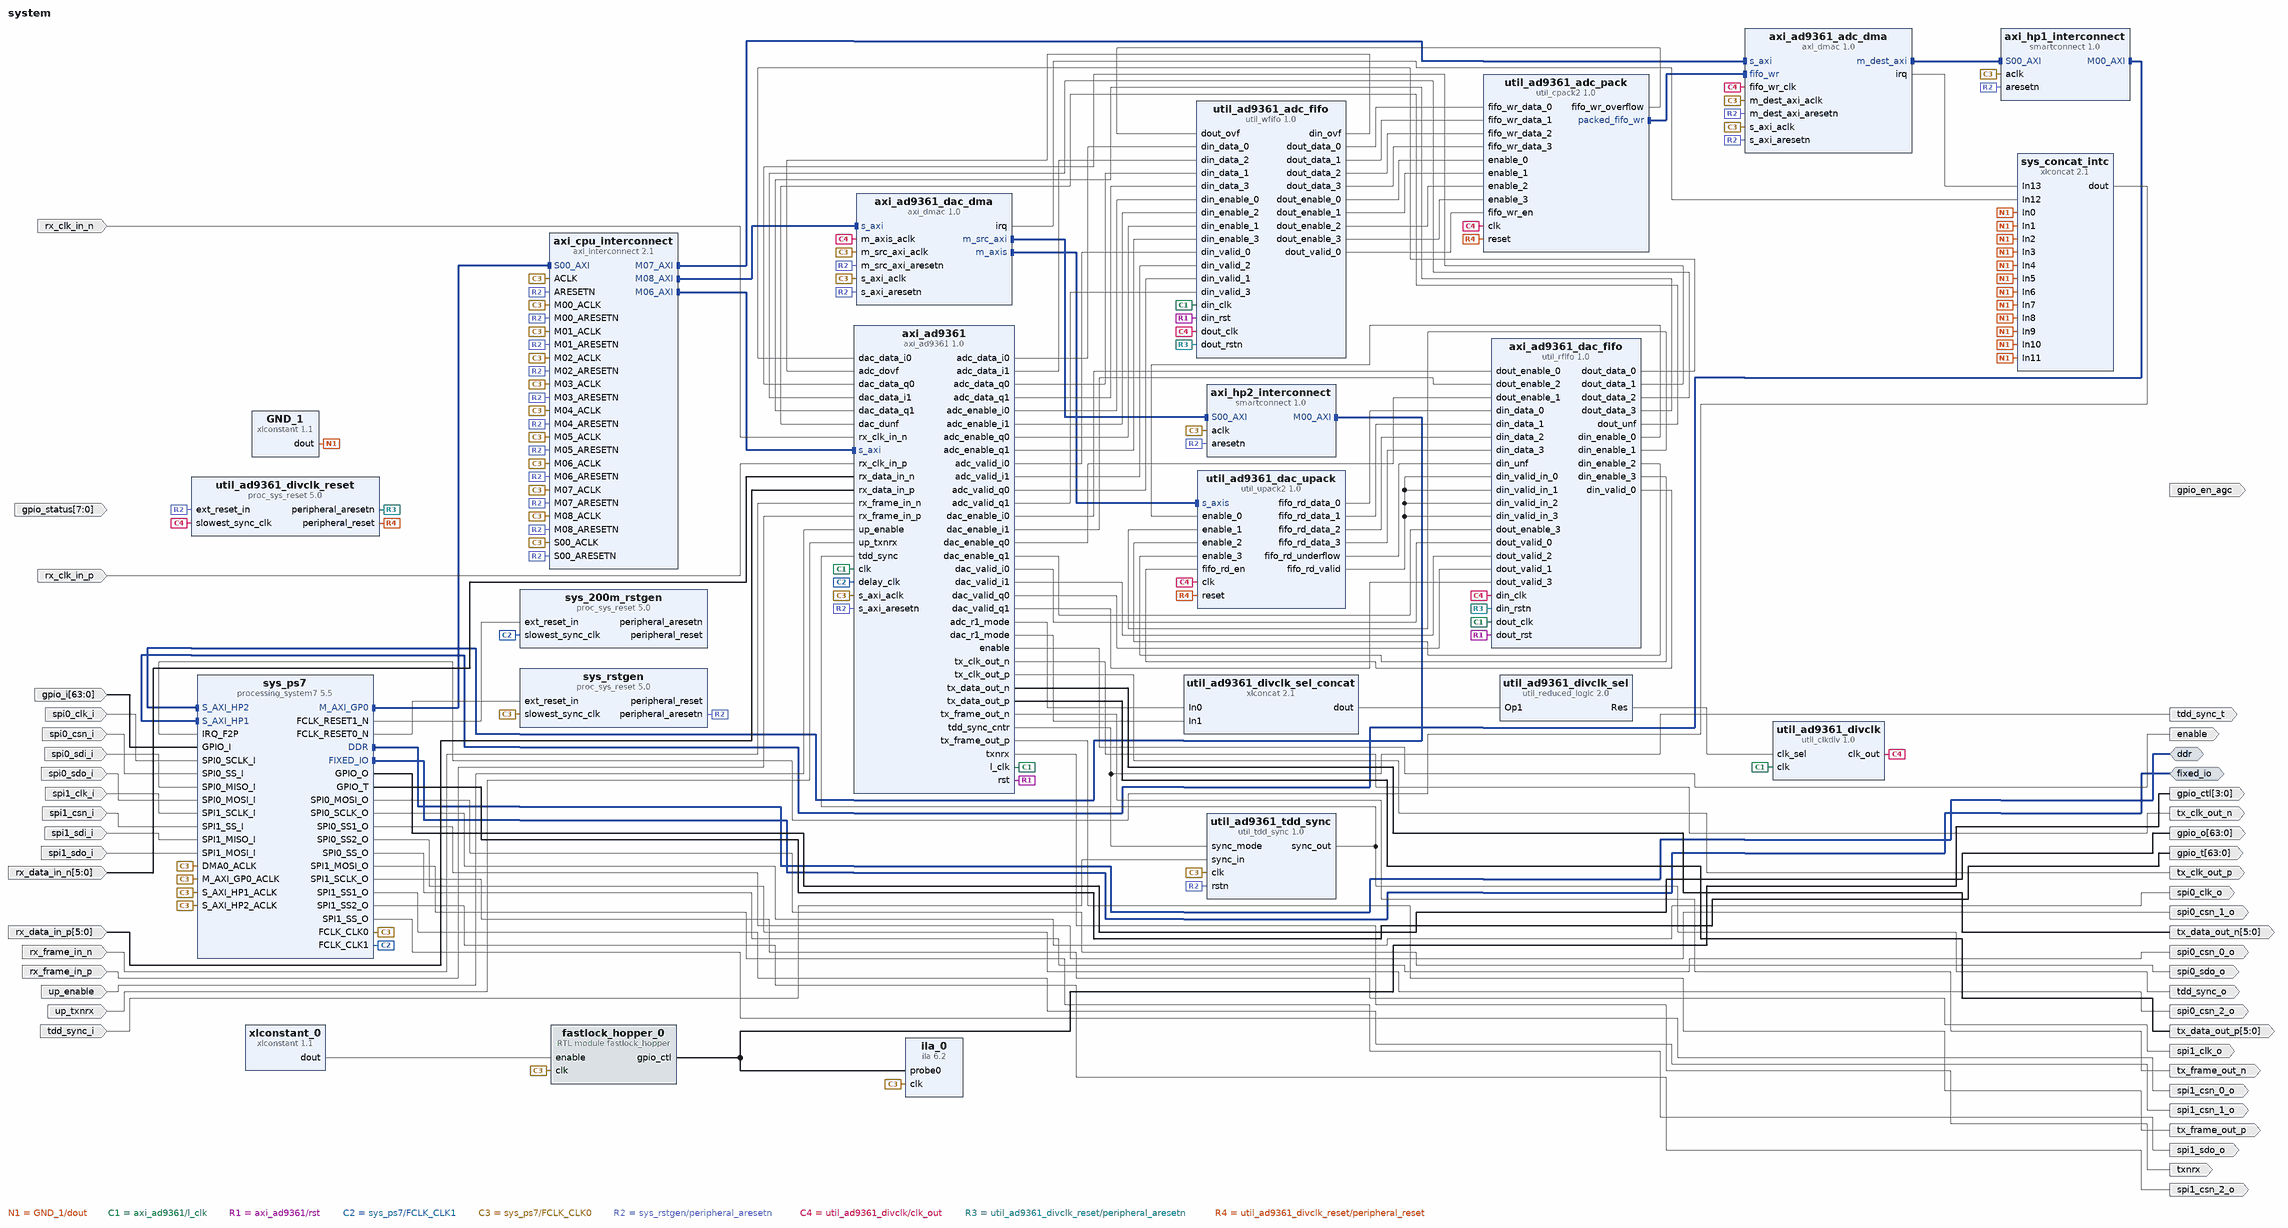
[diagram p0: block diagram of the top level]
# Vivado block design system, xc7z020clg400-2, Vivado 2021.1
create_bd_design system

create_bd_intf_port -mode Master -vlnv xilinx.com:interface:ddrx_rtl:1.0 ddr
create_bd_intf_port -mode Master -vlnv xilinx.com:display_processing_system7:fixedio_rtl:1.0 fixed_io
create_bd_port -dir O spi0_csn_2_o
create_bd_port -dir O spi0_csn_1_o
create_bd_port -dir O spi0_csn_0_o
create_bd_port -dir I spi0_csn_i
create_bd_port -dir I spi0_clk_i
create_bd_port -dir O spi0_clk_o
create_bd_port -dir I spi0_sdo_i
create_bd_port -dir O spi0_sdo_o
create_bd_port -dir I spi0_sdi_i
create_bd_port -dir O spi1_csn_2_o
create_bd_port -dir O spi1_csn_1_o
create_bd_port -dir O spi1_csn_0_o
create_bd_port -dir I spi1_csn_i
create_bd_port -dir I spi1_clk_i
create_bd_port -dir O spi1_clk_o
create_bd_port -dir I spi1_sdo_i
create_bd_port -dir O spi1_sdo_o
create_bd_port -dir I spi1_sdi_i
create_bd_port -dir I -from 63 -to 0 gpio_i
create_bd_port -dir O -from 63 -to 0 gpio_o
create_bd_port -dir O -from 63 -to 0 gpio_t
create_bd_port -dir I rx_clk_in_p
create_bd_port -dir I rx_clk_in_n
create_bd_port -dir I rx_frame_in_p
create_bd_port -dir I rx_frame_in_n
create_bd_port -dir I -from 5 -to 0 rx_data_in_p
create_bd_port -dir I -from 5 -to 0 rx_data_in_n
create_bd_port -dir O tx_clk_out_p
create_bd_port -dir O tx_clk_out_n
create_bd_port -dir O tx_frame_out_p
create_bd_port -dir O tx_frame_out_n
create_bd_port -dir O -from 5 -to 0 tx_data_out_p
create_bd_port -dir O -from 5 -to 0 tx_data_out_n
create_bd_port -dir O enable
create_bd_port -dir O txnrx
create_bd_port -dir I up_enable
create_bd_port -dir I up_txnrx
create_bd_port -dir O tdd_sync_o
create_bd_port -dir I tdd_sync_i
create_bd_port -dir O tdd_sync_t
create_bd_port -dir O -from 3 -to 0 -type data gpio_ctl
create_bd_port -dir I -from 7 -to 0 -type data gpio_status
create_bd_port -dir O gpio_en_agc

create_bd_cell -type ip -vlnv xilinx.com:ip:xlconstant:1.1 GND_1
set_property -dict {CONFIG.CONST_VAL 0 CONFIG.CONST_WIDTH 1} [get_bd_cells GND_1]
create_bd_cell -type ip -vlnv analog.com:user:axi_ad9361:1.0 axi_ad9361
set_property -dict [list \
  CONFIG.ADC_INIT_DELAY 23 \
  CONFIG.DAC_DDS_CORDIC_DW 14 \
  CONFIG.DAC_DDS_TYPE 1 \
  CONFIG.ID 0 \
] [get_bd_cells axi_ad9361]
create_bd_cell -type ip -vlnv analog.com:user:axi_dmac:1.0 axi_ad9361_adc_dma
set_property -dict [list \
  CONFIG.ALLOW_ASYM_MEM 1 \
  CONFIG.AXI_SLICE_DEST false \
  CONFIG.AXI_SLICE_SRC false \
  CONFIG.CYCLIC false \
  CONFIG.DMA_2D_TRANSFER false \
  CONFIG.DMA_AXI_PROTOCOL_DEST 1 \
  CONFIG.DMA_DATA_WIDTH_SRC 64 \
  CONFIG.DMA_TYPE_DEST 0 \
  CONFIG.DMA_TYPE_SRC 2 \
  CONFIG.SYNC_TRANSFER_START true \
] [get_bd_cells axi_ad9361_adc_dma]
create_bd_cell -type ip -vlnv analog.com:user:axi_dmac:1.0 axi_ad9361_dac_dma
set_property -dict [list \
  CONFIG.ALLOW_ASYM_MEM 1 \
  CONFIG.AXI_SLICE_DEST false \
  CONFIG.AXI_SLICE_SRC false \
  CONFIG.CYCLIC true \
  CONFIG.DMA_2D_TRANSFER false \
  CONFIG.DMA_AXI_PROTOCOL_SRC 1 \
  CONFIG.DMA_DATA_WIDTH_DEST 64 \
  CONFIG.DMA_TYPE_DEST 1 \
  CONFIG.DMA_TYPE_SRC 0 \
] [get_bd_cells axi_ad9361_dac_dma]
create_bd_cell -type ip -vlnv analog.com:user:util_rfifo:1.0 axi_ad9361_dac_fifo
set_property -dict [list \
  CONFIG.DIN_ADDRESS_WIDTH 4 \
  CONFIG.DIN_DATA_WIDTH 16 \
  CONFIG.DOUT_DATA_WIDTH 16 \
] [get_bd_cells axi_ad9361_dac_fifo]
create_bd_cell -type ip -vlnv xilinx.com:ip:axi_interconnect:2.1 axi_cpu_interconnect
set_property -dict {CONFIG.NUM_MI 9} [get_bd_cells axi_cpu_interconnect]
create_bd_cell -type ip -vlnv xilinx.com:ip:smartconnect:1.0 axi_hp1_interconnect
set_property -dict {CONFIG.NUM_MI 1 CONFIG.NUM_SI 1} [get_bd_cells axi_hp1_interconnect]
create_bd_cell -type ip -vlnv xilinx.com:ip:smartconnect:1.0 axi_hp2_interconnect
set_property -dict {CONFIG.NUM_MI 1 CONFIG.NUM_SI 1} [get_bd_cells axi_hp2_interconnect]
create_bd_cell -type ip -vlnv xilinx.com:ip:proc_sys_reset:5.0 sys_200m_rstgen
set_property -dict {CONFIG.C_EXT_RST_WIDTH 1} [get_bd_cells sys_200m_rstgen]
create_bd_cell -type ip -vlnv xilinx.com:ip:xlconcat:2.1 sys_concat_intc
set_property -dict {CONFIG.NUM_PORTS 16} [get_bd_cells sys_concat_intc]
create_bd_cell -type ip -vlnv xilinx.com:ip:processing_system7:5.5 sys_ps7
set_property -dict [list \
  CONFIG.PCW_APU_PERIPHERAL_FREQMHZ 666.666666 \
  CONFIG.PCW_CPU_CPU_6X4X_MAX_RANGE 767 \
  CONFIG.PCW_ENET0_ENET0_IO {MIO 16 .. 27} \
  CONFIG.PCW_ENET0_GRP_MDIO_ENABLE 1 \
  CONFIG.PCW_ENET0_GRP_MDIO_IO {MIO 52 .. 53} \
  CONFIG.PCW_ENET0_PERIPHERAL_ENABLE 1 \
  CONFIG.PCW_ENET_RESET_ENABLE 0 \
  CONFIG.PCW_EN_CLK1_PORT 1 \
  CONFIG.PCW_EN_RST1_PORT 1 \
  CONFIG.PCW_FCLK_CLK1_BUF TRUE \
  CONFIG.PCW_FPGA0_PERIPHERAL_FREQMHZ 100.0 \
  CONFIG.PCW_FPGA1_PERIPHERAL_FREQMHZ 200.0 \
  CONFIG.PCW_FPGA_FCLK1_ENABLE 1 \
  CONFIG.PCW_GPIO_EMIO_GPIO_ENABLE 1 \
  CONFIG.PCW_GPIO_EMIO_GPIO_IO 64 \
  CONFIG.PCW_GPIO_MIO_GPIO_ENABLE 1 \
  CONFIG.PCW_GPIO_MIO_GPIO_IO MIO \
  CONFIG.PCW_I2C_RESET_ENABLE 0 \
  CONFIG.PCW_IMPORT_BOARD_PRESET ZC702 \
  CONFIG.PCW_IRQ_F2P_INTR 1 \
  CONFIG.PCW_PERIPHERAL_BOARD_PRESET part0 \
  CONFIG.PCW_PRESET_BANK1_VOLTAGE {LVCMOS 1.8V} \
  CONFIG.PCW_QSPI_GRP_SINGLE_SS_ENABLE 1 \
  CONFIG.PCW_QSPI_GRP_SINGLE_SS_IO {MIO 1 .. 6} \
  CONFIG.PCW_QSPI_PERIPHERAL_ENABLE 1 \
  CONFIG.PCW_QSPI_PERIPHERAL_FREQMHZ 120 \
  CONFIG.PCW_QSPI_QSPI_IO {MIO 1 .. 6} \
  CONFIG.PCW_SD0_GRP_CD_ENABLE 0 \
  CONFIG.PCW_SD0_GRP_WP_ENABLE 0 \
  CONFIG.PCW_SD0_PERIPHERAL_ENABLE 1 \
  CONFIG.PCW_SD0_SD0_IO {MIO 40 .. 45} \
  CONFIG.PCW_SDIO_PERIPHERAL_FREQMHZ 50 \
  CONFIG.PCW_SINGLE_QSPI_DATA_MODE x4 \
  CONFIG.PCW_SPI0_PERIPHERAL_ENABLE 1 \
  CONFIG.PCW_SPI0_SPI0_IO EMIO \
  CONFIG.PCW_SPI1_PERIPHERAL_ENABLE 1 \
  CONFIG.PCW_SPI1_SPI1_IO EMIO \
  CONFIG.PCW_UART1_PERIPHERAL_ENABLE 1 \
  CONFIG.PCW_UART1_UART1_IO {MIO 8 .. 9} \
  CONFIG.PCW_UART_PERIPHERAL_FREQMHZ 50 \
  CONFIG.PCW_UIPARAM_DDR_FREQ_MHZ 533.333 \
  CONFIG.PCW_UIPARAM_DDR_MEMORY_TYPE {DDR 3 (Low Voltage)} \
  CONFIG.PCW_UIPARAM_DDR_PARTNO {MT41K256M16 RE-125} \
  CONFIG.PCW_USB0_PERIPHERAL_ENABLE 1 \
  CONFIG.PCW_USB0_RESET_ENABLE 1 \
  CONFIG.PCW_USB0_RESET_IO {MIO 46} \
  CONFIG.PCW_USB0_USB0_IO {MIO 28 .. 39} \
  CONFIG.PCW_USB_RESET_ENABLE 1 \
  CONFIG.PCW_USB_RESET_SELECT {Share reset pin} \
  CONFIG.PCW_USE_DMA0 1 \
  CONFIG.PCW_USE_FABRIC_INTERRUPT 1 \
  CONFIG.PCW_USE_S_AXI_HP1 1 \
  CONFIG.PCW_USE_S_AXI_HP2 1 \
] [get_bd_cells sys_ps7]
# 519 more settings of sys_ps7 are not shown: defaults, MIO pin electricals, DDR timing, and values the tool derives
create_bd_cell -type ip -vlnv xilinx.com:ip:proc_sys_reset:5.0 sys_rstgen
set_property -dict {CONFIG.C_EXT_RST_WIDTH 1} [get_bd_cells sys_rstgen]
create_bd_cell -type ip -vlnv analog.com:user:util_wfifo:1.0 util_ad9361_adc_fifo
set_property -dict [list \
  CONFIG.DIN_ADDRESS_WIDTH 4 \
  CONFIG.DIN_DATA_WIDTH 16 \
  CONFIG.DOUT_DATA_WIDTH 16 \
  CONFIG.NUM_OF_CHANNELS 4 \
] [get_bd_cells util_ad9361_adc_fifo]
create_bd_cell -type ip -vlnv analog.com:user:util_cpack2:1.0 util_ad9361_adc_pack
set_property -dict {CONFIG.NUM_OF_CHANNELS 4 CONFIG.SAMPLE_DATA_WIDTH 16} [get_bd_cells util_ad9361_adc_pack]
create_bd_cell -type ip -vlnv analog.com:user:util_upack2:1.0 util_ad9361_dac_upack
set_property -dict {CONFIG.NUM_OF_CHANNELS 4 CONFIG.SAMPLE_DATA_WIDTH 16} [get_bd_cells util_ad9361_dac_upack]
create_bd_cell -type ip -vlnv analog.com:user:util_clkdiv:1.0 util_ad9361_divclk
create_bd_cell -type ip -vlnv xilinx.com:ip:proc_sys_reset:5.0 util_ad9361_divclk_reset
create_bd_cell -type ip -vlnv xilinx.com:ip:util_reduced_logic:2.0 util_ad9361_divclk_sel
set_property -dict {CONFIG.C_SIZE 2} [get_bd_cells util_ad9361_divclk_sel]
create_bd_cell -type ip -vlnv xilinx.com:ip:xlconcat:2.1 util_ad9361_divclk_sel_concat
set_property -dict {CONFIG.NUM_PORTS 2} [get_bd_cells util_ad9361_divclk_sel_concat]
create_bd_cell -type ip -vlnv analog.com:user:util_tdd_sync:1.0 util_ad9361_tdd_sync
set_property -dict {CONFIG.TDD_SYNC_PERIOD 10000000} [get_bd_cells util_ad9361_tdd_sync]
create_bd_cell -type ip -vlnv xilinx.com:ip:ila:6.2 ila_0
set_property -dict [list \
  CONFIG.ALL_PROBE_SAME_MU true \
  CONFIG.C_MONITOR_TYPE Native \
  CONFIG.C_NUM_OF_PROBES 1 \
  CONFIG.C_PROBE0_WIDTH 4 \
  CONFIG.C_TRIGIN_EN false \
] [get_bd_cells ila_0]
create_bd_cell -type ip -vlnv xilinx.com:ip:xlconstant:1.1 xlconstant_0
create_bd_cell -type module -reference fastlock_hopper fastlock_hopper_0

# ---- connections ----

connect_bd_intf_net [get_bd_intf_pins axi_cpu_interconnect/S00_AXI] [get_bd_intf_pins sys_ps7/M_AXI_GP0]
connect_bd_intf_net [get_bd_intf_pins axi_hp1_interconnect/S00_AXI] [get_bd_intf_pins axi_ad9361_adc_dma/m_dest_axi]
connect_bd_intf_net [get_bd_intf_pins axi_ad9361_dac_dma/m_axis] [get_bd_intf_pins util_ad9361_dac_upack/s_axis]
connect_bd_intf_net [get_bd_intf_pins axi_hp2_interconnect/S00_AXI] [get_bd_intf_pins axi_ad9361_dac_dma/m_src_axi]
connect_bd_intf_net [get_bd_intf_pins axi_cpu_interconnect/M06_AXI] [get_bd_intf_pins axi_ad9361/s_axi]
connect_bd_intf_net [get_bd_intf_pins axi_cpu_interconnect/M07_AXI] [get_bd_intf_pins axi_ad9361_adc_dma/s_axi]
connect_bd_intf_net [get_bd_intf_pins axi_cpu_interconnect/M08_AXI] [get_bd_intf_pins axi_ad9361_dac_dma/s_axi]
connect_bd_intf_net [get_bd_intf_pins axi_hp1_interconnect/M00_AXI] [get_bd_intf_pins sys_ps7/S_AXI_HP1]
connect_bd_intf_net [get_bd_intf_pins axi_hp2_interconnect/M00_AXI] [get_bd_intf_pins sys_ps7/S_AXI_HP2]
connect_bd_intf_net [get_bd_intf_ports ddr] [get_bd_intf_pins sys_ps7/DDR]
connect_bd_intf_net [get_bd_intf_ports fixed_io] [get_bd_intf_pins sys_ps7/FIXED_IO]
connect_bd_intf_net [get_bd_intf_pins util_ad9361_adc_pack/packed_fifo_wr] [get_bd_intf_pins axi_ad9361_adc_dma/fifo_wr]
connect_bd_net [get_bd_pins GND_1/dout] \
  [get_bd_pins sys_concat_intc/In0] [get_bd_pins sys_concat_intc/In1] [get_bd_pins sys_concat_intc/In2] \
  [get_bd_pins sys_concat_intc/In3] [get_bd_pins sys_concat_intc/In4] [get_bd_pins sys_concat_intc/In5] \
  [get_bd_pins sys_concat_intc/In6] [get_bd_pins sys_concat_intc/In7] [get_bd_pins sys_concat_intc/In8] \
  [get_bd_pins sys_concat_intc/In9] [get_bd_pins sys_concat_intc/In10] [get_bd_pins sys_concat_intc/In11]
connect_bd_net [get_bd_pins axi_ad9361/adc_data_i0] [get_bd_pins util_ad9361_adc_fifo/din_data_0]
connect_bd_net [get_bd_pins axi_ad9361/adc_data_i1] [get_bd_pins util_ad9361_adc_fifo/din_data_2]
connect_bd_net [get_bd_pins axi_ad9361/adc_data_q0] [get_bd_pins util_ad9361_adc_fifo/din_data_1]
connect_bd_net [get_bd_pins axi_ad9361/adc_data_q1] [get_bd_pins util_ad9361_adc_fifo/din_data_3]
connect_bd_net [get_bd_pins axi_ad9361_adc_dma/irq] [get_bd_pins sys_concat_intc/In13]
connect_bd_net [get_bd_pins axi_ad9361/adc_enable_i0] [get_bd_pins util_ad9361_adc_fifo/din_enable_0]
connect_bd_net [get_bd_pins axi_ad9361/adc_enable_i1] [get_bd_pins util_ad9361_adc_fifo/din_enable_2]
connect_bd_net [get_bd_pins axi_ad9361/adc_enable_q0] [get_bd_pins util_ad9361_adc_fifo/din_enable_1]
connect_bd_net [get_bd_pins axi_ad9361/adc_enable_q1] [get_bd_pins util_ad9361_adc_fifo/din_enable_3]
connect_bd_net [get_bd_pins axi_ad9361/adc_r1_mode] [get_bd_pins util_ad9361_divclk_sel_concat/In0]
connect_bd_net [get_bd_pins axi_ad9361/adc_valid_i0] [get_bd_pins util_ad9361_adc_fifo/din_valid_0]
connect_bd_net [get_bd_pins axi_ad9361/adc_valid_i1] [get_bd_pins util_ad9361_adc_fifo/din_valid_2]
connect_bd_net [get_bd_pins axi_ad9361/adc_valid_q0] [get_bd_pins util_ad9361_adc_fifo/din_valid_1]
connect_bd_net [get_bd_pins axi_ad9361/adc_valid_q1] [get_bd_pins util_ad9361_adc_fifo/din_valid_3]
connect_bd_net [get_bd_pins axi_ad9361_dac_dma/irq] [get_bd_pins sys_concat_intc/In12]
connect_bd_net [get_bd_pins axi_ad9361/dac_enable_i0] [get_bd_pins axi_ad9361_dac_fifo/dout_enable_0]
connect_bd_net [get_bd_pins axi_ad9361/dac_enable_i1] [get_bd_pins axi_ad9361_dac_fifo/dout_enable_2]
connect_bd_net [get_bd_pins axi_ad9361/dac_enable_q0] [get_bd_pins axi_ad9361_dac_fifo/dout_enable_1]
connect_bd_net [get_bd_pins axi_ad9361/dac_enable_q1] [get_bd_pins axi_ad9361_dac_fifo/dout_enable_3]
connect_bd_net [get_bd_pins axi_ad9361_dac_fifo/din_enable_0] [get_bd_pins util_ad9361_dac_upack/enable_0]
connect_bd_net [get_bd_pins axi_ad9361_dac_fifo/din_enable_1] [get_bd_pins util_ad9361_dac_upack/enable_1]
connect_bd_net [get_bd_pins axi_ad9361_dac_fifo/din_enable_2] [get_bd_pins util_ad9361_dac_upack/enable_2]
connect_bd_net [get_bd_pins axi_ad9361_dac_fifo/din_enable_3] [get_bd_pins util_ad9361_dac_upack/enable_3]
connect_bd_net [get_bd_pins axi_ad9361_dac_fifo/din_valid_0] [get_bd_pins util_ad9361_dac_upack/fifo_rd_en]
connect_bd_net [get_bd_pins axi_ad9361_dac_fifo/dout_data_0] [get_bd_pins axi_ad9361/dac_data_i0]
connect_bd_net [get_bd_pins axi_ad9361_dac_fifo/dout_data_1] [get_bd_pins axi_ad9361/dac_data_q0]
connect_bd_net [get_bd_pins axi_ad9361_dac_fifo/dout_data_2] [get_bd_pins axi_ad9361/dac_data_i1]
connect_bd_net [get_bd_pins axi_ad9361_dac_fifo/dout_data_3] [get_bd_pins axi_ad9361/dac_data_q1]
connect_bd_net [get_bd_pins axi_ad9361_dac_fifo/dout_unf] [get_bd_pins axi_ad9361/dac_dunf]
connect_bd_net [get_bd_pins axi_ad9361/dac_r1_mode] [get_bd_pins util_ad9361_divclk_sel_concat/In1]
connect_bd_net [get_bd_pins axi_ad9361/dac_valid_i0] [get_bd_pins axi_ad9361_dac_fifo/dout_valid_0]
connect_bd_net [get_bd_pins axi_ad9361/dac_valid_i1] [get_bd_pins axi_ad9361_dac_fifo/dout_valid_2]
connect_bd_net [get_bd_pins axi_ad9361/dac_valid_q0] [get_bd_pins axi_ad9361_dac_fifo/dout_valid_1]
connect_bd_net [get_bd_pins axi_ad9361/dac_valid_q1] [get_bd_pins axi_ad9361_dac_fifo/dout_valid_3]
connect_bd_net [get_bd_pins axi_ad9361/enable] [get_bd_ports enable]
connect_bd_net [get_bd_pins axi_ad9361/l_clk] \
  [get_bd_pins axi_ad9361/clk] [get_bd_pins axi_ad9361_dac_fifo/dout_clk] [get_bd_pins util_ad9361_adc_fifo/din_clk] \
  [get_bd_pins util_ad9361_divclk/clk]
connect_bd_net [get_bd_pins axi_ad9361/rst] [get_bd_pins axi_ad9361_dac_fifo/dout_rst] [get_bd_pins util_ad9361_adc_fifo/din_rst]
connect_bd_net [get_bd_pins axi_ad9361/tdd_sync_cntr] [get_bd_ports tdd_sync_t] [get_bd_pins util_ad9361_tdd_sync/sync_mode]
connect_bd_net [get_bd_pins axi_ad9361/tx_clk_out_n] [get_bd_ports tx_clk_out_n]
connect_bd_net [get_bd_pins axi_ad9361/tx_clk_out_p] [get_bd_ports tx_clk_out_p]
connect_bd_net [get_bd_pins axi_ad9361/tx_data_out_n] [get_bd_ports tx_data_out_n]
connect_bd_net [get_bd_pins axi_ad9361/tx_data_out_p] [get_bd_ports tx_data_out_p]
connect_bd_net [get_bd_pins axi_ad9361/tx_frame_out_n] [get_bd_ports tx_frame_out_n]
connect_bd_net [get_bd_pins axi_ad9361/tx_frame_out_p] [get_bd_ports tx_frame_out_p]
connect_bd_net [get_bd_pins axi_ad9361/txnrx] [get_bd_ports txnrx]
connect_bd_net [get_bd_pins fastlock_hopper_0/gpio_ctl] [get_bd_ports gpio_ctl] [get_bd_pins ila_0/probe0]
connect_bd_net [get_bd_ports gpio_i] [get_bd_pins sys_ps7/GPIO_I]
connect_bd_net [get_bd_ports rx_clk_in_n] [get_bd_pins axi_ad9361/rx_clk_in_n]
connect_bd_net [get_bd_ports rx_clk_in_p] [get_bd_pins axi_ad9361/rx_clk_in_p]
connect_bd_net [get_bd_ports rx_data_in_n] [get_bd_pins axi_ad9361/rx_data_in_n]
connect_bd_net [get_bd_ports rx_data_in_p] [get_bd_pins axi_ad9361/rx_data_in_p]
connect_bd_net [get_bd_ports rx_frame_in_n] [get_bd_pins axi_ad9361/rx_frame_in_n]
connect_bd_net [get_bd_ports rx_frame_in_p] [get_bd_pins axi_ad9361/rx_frame_in_p]
connect_bd_net [get_bd_ports spi0_clk_i] [get_bd_pins sys_ps7/SPI0_SCLK_I]
connect_bd_net [get_bd_ports spi0_csn_i] [get_bd_pins sys_ps7/SPI0_SS_I]
connect_bd_net [get_bd_ports spi0_sdi_i] [get_bd_pins sys_ps7/SPI0_MISO_I]
connect_bd_net [get_bd_ports spi0_sdo_i] [get_bd_pins sys_ps7/SPI0_MOSI_I]
connect_bd_net [get_bd_ports spi1_clk_i] [get_bd_pins sys_ps7/SPI1_SCLK_I]
connect_bd_net [get_bd_ports spi1_csn_i] [get_bd_pins sys_ps7/SPI1_SS_I]
connect_bd_net [get_bd_ports spi1_sdi_i] [get_bd_pins sys_ps7/SPI1_MISO_I]
connect_bd_net [get_bd_ports spi1_sdo_i] [get_bd_pins sys_ps7/SPI1_MOSI_I]
connect_bd_net -net sys_200m_clk [get_bd_pins sys_ps7/FCLK_CLK1] [get_bd_pins axi_ad9361/delay_clk] [get_bd_pins sys_200m_rstgen/slowest_sync_clk]
# net sys_200m_reset has one end: sys_200m_rstgen/peripheral_reset
# net sys_200m_resetn has one end: sys_200m_rstgen/peripheral_aresetn
connect_bd_net [get_bd_pins sys_concat_intc/dout] [get_bd_pins sys_ps7/IRQ_F2P]
connect_bd_net -net sys_cpu_clk [get_bd_pins sys_ps7/FCLK_CLK0] \
  [get_bd_pins axi_ad9361/s_axi_aclk] [get_bd_pins axi_ad9361_adc_dma/s_axi_aclk] \
  [get_bd_pins axi_ad9361_adc_dma/m_dest_axi_aclk] [get_bd_pins axi_ad9361_dac_dma/s_axi_aclk] \
  [get_bd_pins axi_ad9361_dac_dma/m_src_axi_aclk] [get_bd_pins axi_cpu_interconnect/ACLK] \
  [get_bd_pins axi_cpu_interconnect/S00_ACLK] [get_bd_pins axi_cpu_interconnect/M00_ACLK] \
  [get_bd_pins axi_cpu_interconnect/M01_ACLK] [get_bd_pins axi_cpu_interconnect/M02_ACLK] \
  [get_bd_pins axi_cpu_interconnect/M03_ACLK] [get_bd_pins axi_cpu_interconnect/M04_ACLK] \
  [get_bd_pins axi_cpu_interconnect/M05_ACLK] [get_bd_pins axi_cpu_interconnect/M06_ACLK] \
  [get_bd_pins axi_cpu_interconnect/M07_ACLK] [get_bd_pins axi_cpu_interconnect/M08_ACLK] \
  [get_bd_pins axi_hp1_interconnect/aclk] [get_bd_pins axi_hp2_interconnect/aclk] [get_bd_pins sys_ps7/M_AXI_GP0_ACLK] \
  [get_bd_pins sys_ps7/S_AXI_HP1_ACLK] [get_bd_pins sys_ps7/S_AXI_HP2_ACLK] [get_bd_pins sys_ps7/DMA0_ACLK] \
  [get_bd_pins sys_rstgen/slowest_sync_clk] [get_bd_pins util_ad9361_tdd_sync/clk] [get_bd_pins ila_0/clk] \
  [get_bd_pins fastlock_hopper_0/clk]
# net sys_cpu_reset has one end: sys_rstgen/peripheral_reset
connect_bd_net -net sys_cpu_resetn [get_bd_pins sys_rstgen/peripheral_aresetn] \
  [get_bd_pins axi_ad9361/s_axi_aresetn] [get_bd_pins axi_ad9361_adc_dma/s_axi_aresetn] \
  [get_bd_pins axi_ad9361_adc_dma/m_dest_axi_aresetn] [get_bd_pins axi_ad9361_dac_dma/s_axi_aresetn] \
  [get_bd_pins axi_ad9361_dac_dma/m_src_axi_aresetn] [get_bd_pins axi_cpu_interconnect/ARESETN] \
  [get_bd_pins axi_cpu_interconnect/S00_ARESETN] [get_bd_pins axi_cpu_interconnect/M00_ARESETN] \
  [get_bd_pins axi_cpu_interconnect/M01_ARESETN] [get_bd_pins axi_cpu_interconnect/M02_ARESETN] \
  [get_bd_pins axi_cpu_interconnect/M03_ARESETN] [get_bd_pins axi_cpu_interconnect/M04_ARESETN] \
  [get_bd_pins axi_cpu_interconnect/M05_ARESETN] [get_bd_pins axi_cpu_interconnect/M06_ARESETN] \
  [get_bd_pins axi_cpu_interconnect/M07_ARESETN] [get_bd_pins axi_cpu_interconnect/M08_ARESETN] \
  [get_bd_pins axi_hp1_interconnect/aresetn] [get_bd_pins axi_hp2_interconnect/aresetn] \
  [get_bd_pins util_ad9361_divclk_reset/ext_reset_in] [get_bd_pins util_ad9361_tdd_sync/rstn]
connect_bd_net [get_bd_pins sys_ps7/FCLK_RESET0_N] [get_bd_pins sys_rstgen/ext_reset_in]
connect_bd_net [get_bd_pins sys_ps7/FCLK_RESET1_N] [get_bd_pins sys_200m_rstgen/ext_reset_in]
connect_bd_net [get_bd_pins sys_ps7/GPIO_O] [get_bd_ports gpio_o]
connect_bd_net [get_bd_pins sys_ps7/GPIO_T] [get_bd_ports gpio_t]
connect_bd_net [get_bd_pins sys_ps7/SPI0_MOSI_O] [get_bd_ports spi0_sdo_o]
connect_bd_net [get_bd_pins sys_ps7/SPI0_SCLK_O] [get_bd_ports spi0_clk_o]
connect_bd_net [get_bd_pins sys_ps7/SPI0_SS1_O] [get_bd_ports spi0_csn_1_o]
connect_bd_net [get_bd_pins sys_ps7/SPI0_SS2_O] [get_bd_ports spi0_csn_2_o]
connect_bd_net [get_bd_pins sys_ps7/SPI0_SS_O] [get_bd_ports spi0_csn_0_o]
connect_bd_net [get_bd_pins sys_ps7/SPI1_MOSI_O] [get_bd_ports spi1_sdo_o]
connect_bd_net [get_bd_pins sys_ps7/SPI1_SCLK_O] [get_bd_ports spi1_clk_o]
connect_bd_net [get_bd_pins sys_ps7/SPI1_SS1_O] [get_bd_ports spi1_csn_1_o]
connect_bd_net [get_bd_pins sys_ps7/SPI1_SS2_O] [get_bd_ports spi1_csn_2_o]
connect_bd_net [get_bd_pins sys_ps7/SPI1_SS_O] [get_bd_ports spi1_csn_0_o]
connect_bd_net [get_bd_ports tdd_sync_i] [get_bd_pins util_ad9361_tdd_sync/sync_in]
connect_bd_net [get_bd_ports up_enable] [get_bd_pins axi_ad9361/up_enable]
connect_bd_net [get_bd_ports up_txnrx] [get_bd_pins axi_ad9361/up_txnrx]
connect_bd_net [get_bd_pins util_ad9361_adc_fifo/din_ovf] [get_bd_pins axi_ad9361/adc_dovf]
connect_bd_net [get_bd_pins util_ad9361_adc_fifo/dout_data_0] [get_bd_pins util_ad9361_adc_pack/fifo_wr_data_0]
connect_bd_net [get_bd_pins util_ad9361_adc_fifo/dout_data_1] [get_bd_pins util_ad9361_adc_pack/fifo_wr_data_1]
connect_bd_net [get_bd_pins util_ad9361_adc_fifo/dout_data_2] [get_bd_pins util_ad9361_adc_pack/fifo_wr_data_2]
connect_bd_net [get_bd_pins util_ad9361_adc_fifo/dout_data_3] [get_bd_pins util_ad9361_adc_pack/fifo_wr_data_3]
connect_bd_net [get_bd_pins util_ad9361_adc_fifo/dout_enable_0] [get_bd_pins util_ad9361_adc_pack/enable_0]
connect_bd_net [get_bd_pins util_ad9361_adc_fifo/dout_enable_1] [get_bd_pins util_ad9361_adc_pack/enable_1]
connect_bd_net [get_bd_pins util_ad9361_adc_fifo/dout_enable_2] [get_bd_pins util_ad9361_adc_pack/enable_2]
connect_bd_net [get_bd_pins util_ad9361_adc_fifo/dout_enable_3] [get_bd_pins util_ad9361_adc_pack/enable_3]
connect_bd_net [get_bd_pins util_ad9361_adc_fifo/dout_valid_0] [get_bd_pins util_ad9361_adc_pack/fifo_wr_en]
connect_bd_net [get_bd_pins util_ad9361_adc_pack/fifo_wr_overflow] [get_bd_pins util_ad9361_adc_fifo/dout_ovf]
connect_bd_net [get_bd_pins util_ad9361_dac_upack/fifo_rd_data_0] [get_bd_pins axi_ad9361_dac_fifo/din_data_0]
connect_bd_net [get_bd_pins util_ad9361_dac_upack/fifo_rd_data_1] [get_bd_pins axi_ad9361_dac_fifo/din_data_1]
connect_bd_net [get_bd_pins util_ad9361_dac_upack/fifo_rd_data_2] [get_bd_pins axi_ad9361_dac_fifo/din_data_2]
connect_bd_net [get_bd_pins util_ad9361_dac_upack/fifo_rd_data_3] [get_bd_pins axi_ad9361_dac_fifo/din_data_3]
connect_bd_net [get_bd_pins util_ad9361_dac_upack/fifo_rd_underflow] [get_bd_pins axi_ad9361_dac_fifo/din_unf]
connect_bd_net [get_bd_pins util_ad9361_dac_upack/fifo_rd_valid] \
  [get_bd_pins axi_ad9361_dac_fifo/din_valid_in_0] [get_bd_pins axi_ad9361_dac_fifo/din_valid_in_1] \
  [get_bd_pins axi_ad9361_dac_fifo/din_valid_in_2] [get_bd_pins axi_ad9361_dac_fifo/din_valid_in_3]
connect_bd_net [get_bd_pins util_ad9361_divclk/clk_out] \
  [get_bd_pins axi_ad9361_adc_dma/fifo_wr_clk] [get_bd_pins axi_ad9361_dac_dma/m_axis_aclk] \
  [get_bd_pins axi_ad9361_dac_fifo/din_clk] [get_bd_pins util_ad9361_adc_fifo/dout_clk] \
  [get_bd_pins util_ad9361_adc_pack/clk] [get_bd_pins util_ad9361_dac_upack/clk] \
  [get_bd_pins util_ad9361_divclk_reset/slowest_sync_clk]
connect_bd_net [get_bd_pins util_ad9361_divclk_reset/peripheral_aresetn] \
  [get_bd_pins axi_ad9361_dac_fifo/din_rstn] [get_bd_pins util_ad9361_adc_fifo/dout_rstn]
connect_bd_net [get_bd_pins util_ad9361_divclk_reset/peripheral_reset] \
  [get_bd_pins util_ad9361_adc_pack/reset] [get_bd_pins util_ad9361_dac_upack/reset]
connect_bd_net [get_bd_pins util_ad9361_divclk_sel/Res] [get_bd_pins util_ad9361_divclk/clk_sel]
connect_bd_net [get_bd_pins util_ad9361_divclk_sel_concat/dout] [get_bd_pins util_ad9361_divclk_sel/Op1]
connect_bd_net [get_bd_pins util_ad9361_tdd_sync/sync_out] [get_bd_ports tdd_sync_o] [get_bd_pins axi_ad9361/tdd_sync]
connect_bd_net [get_bd_pins xlconstant_0/dout] [get_bd_pins fastlock_hopper_0/enable]

# ---- address map ----
assign_bd_address -offset 0x00000000 -range 1G -target_address_space [get_bd_addr_spaces axi_ad9361_adc_dma/m_dest_axi] [get_bd_addr_segs sys_ps7/S_AXI_HP1/HP1_DDR_LOWOCM]
assign_bd_address -offset 0x00000000 -range 1G -target_address_space [get_bd_addr_spaces axi_ad9361_dac_dma/m_src_axi] [get_bd_addr_segs sys_ps7/S_AXI_HP2/HP2_DDR_LOWOCM]
assign_bd_address -offset 0x79020000 -range 64K -target_address_space [get_bd_addr_spaces sys_ps7/Data] [get_bd_addr_segs axi_ad9361/s_axi/axi_lite]
assign_bd_address -offset 0x7C400000 -range 4K -target_address_space [get_bd_addr_spaces sys_ps7/Data] [get_bd_addr_segs axi_ad9361_adc_dma/s_axi/axi_lite]
assign_bd_address -offset 0x7C420000 -range 4K -target_address_space [get_bd_addr_spaces sys_ps7/Data] [get_bd_addr_segs axi_ad9361_dac_dma/s_axi/axi_lite]

validate_bd_design
save_bd_design
